# EAGLE schematic Mainboard v13 (EAGLE 9.4.2)

## Sheet 1 of 4
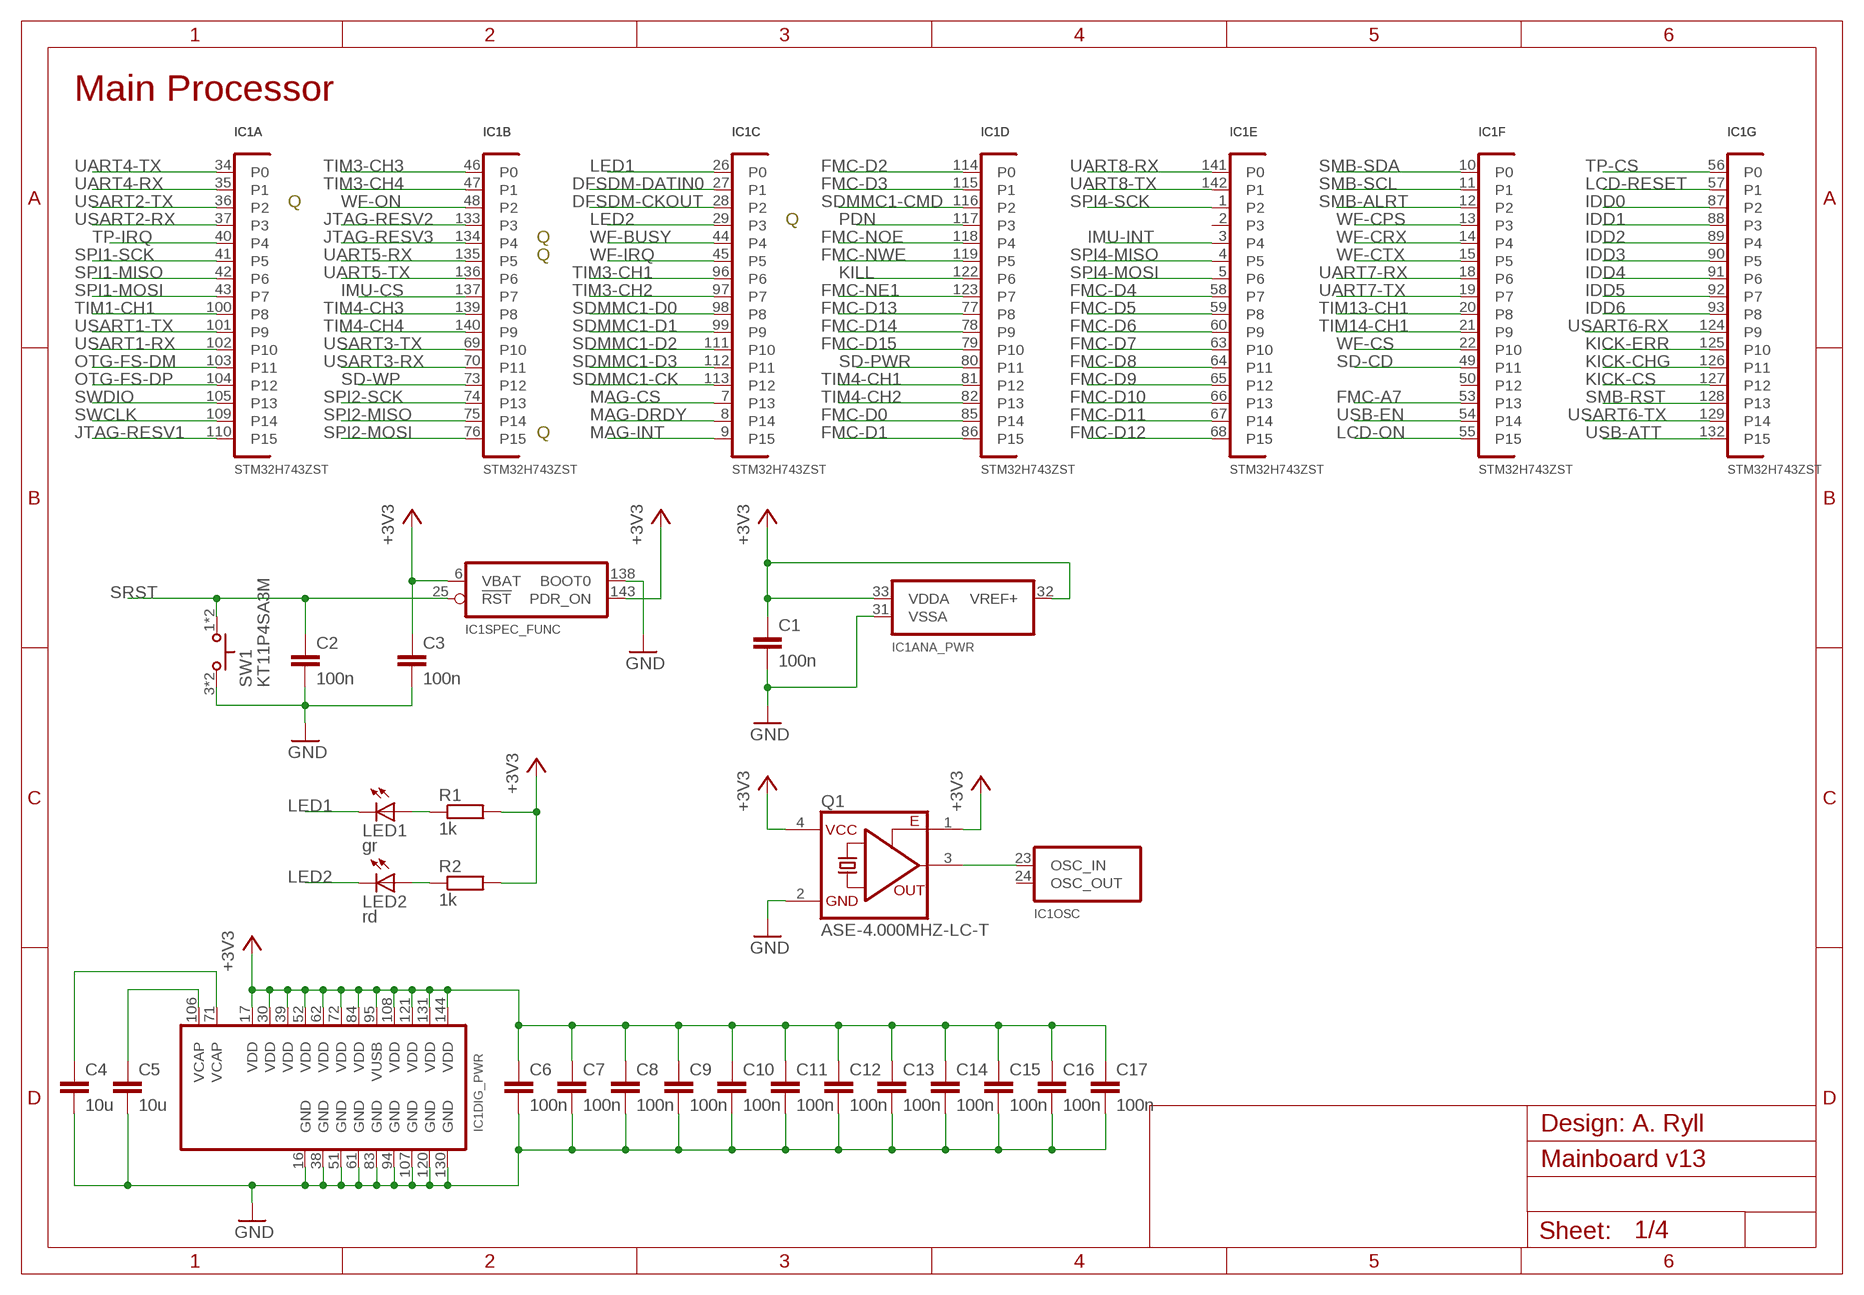
[diagram p0: schematic, sheet 1]

### Parts
C1  100n  C-EUC0603  [C0603]
C2  100n  C-EUC0603  [C0603]
C3  100n  C-EUC0603  [C0603]
C4  10u  C-EUC0603  [C0603]
C5  10u  C-EUC0603  [C0603]
C6  100n  C-EUC0603  [C0603]
C7  100n  C-EUC0603  [C0603]
C8  100n  C-EUC0603  [C0603]
C9  100n  C-EUC0603  [C0603]
C10  100n  C-EUC0603  [C0603]
C11  100n  C-EUC0603  [C0603]
C12  100n  C-EUC0603  [C0603]
C13  100n  C-EUC0603  [C0603]
C14  100n  C-EUC0603  [C0603]
C15  100n  C-EUC0603  [C0603]
C16  100n  C-EUC0603  [C0603]
C17  100n  C-EUC0603  [C0603]
IC1  STM32H743ZST  [LQFP144-ST]
LED1  gr  LEDCHIP-LED0603  [CHIP-LED0603]
LED2  rd  LEDCHIP-LED0603  [CHIP-LED0603]
Q1  ASE-4.000MHZ-LC-T  OSCIASE  [OSCI-ASE]
R1  1k  R-EU_R0603  [R0603]
R2  1k  R-EU_R0603  [R0603]
SW1  KT11P4SA3M  KT114  [BUTTON4]

### Nets
+3V3: C1.1 C3.1 C6.1 C7.1 C8.1 C9.1 C10.1 C11.1 C12.1 C13.1 C14.1 C15.1 C16.1 C17.1 IC1.6(SPEC_FUNC:VBAT) IC1.17(DIG_PWR:VDD) IC1.30(DIG_PWR:VDD) IC1.32(ANA_PWR:VREF+) IC1.33(ANA_PWR:VDDA) IC1.39(DIG_PWR:VDD) IC1.52(DIG_PWR:VDD) IC1.62(DIG_PWR:VDD) IC1.72(DIG_PWR:VDD) IC1.84(DIG_PWR:VDD) IC1.95(DIG_PWR:VUSB) IC1.108(DIG_PWR:VDD) IC1.121(DIG_PWR:VDD) IC1.131(DIG_PWR:VDD) IC1.143(SPEC_FUNC:PDR_ON) IC1.144(DIG_PWR:VDD) Q1.1(OE) Q1.4(VCC) R1.2 R2.2 ; also sheet 2,4
DFSDM-CKOUT: IC1.28(C:P2) ; also sheet 2
DFSDM-DATIN0: IC1.27(C:P1) ; also sheet 2
FMC-A7: IC1.53(F:P13) ; also sheet 2
FMC-D0: IC1.85(D:P14) ; also sheet 2
FMC-D1: IC1.86(D:P15) ; also sheet 2
FMC-D2: IC1.114(D:P0) ; also sheet 2
FMC-D3: IC1.115(D:P1) ; also sheet 2
FMC-D4: IC1.58(E:P7) ; also sheet 2
FMC-D5: IC1.59(E:P8) ; also sheet 2
FMC-D6: IC1.60(E:P9) ; also sheet 2
FMC-D7: IC1.63(E:P10) ; also sheet 2
FMC-D8: IC1.64(E:P11) ; also sheet 2
FMC-D9: IC1.65(E:P12) ; also sheet 2
FMC-D10: IC1.66(E:P13) ; also sheet 2
FMC-D11: IC1.67(E:P14) ; also sheet 2
FMC-D12: IC1.68(E:P15) ; also sheet 2
FMC-D13: IC1.77(D:P8) ; also sheet 2
FMC-D14: IC1.78(D:P9) ; also sheet 2
FMC-D15: IC1.79(D:P10) ; also sheet 2
FMC-NE1: IC1.123(D:P7) ; also sheet 2
FMC-NOE: IC1.118(D:P4) ; also sheet 2
FMC-NWE: IC1.119(D:P5) ; also sheet 2
GND: C1.2 C2.2 C3.2 C4.2 C5.2 C6.2 C7.2 C8.2 C9.2 C10.2 C11.2 C12.2 C13.2 C14.2 C15.2 C16.2 C17.2 IC1.16(DIG_PWR:GND) IC1.31(ANA_PWR:VSSA) IC1.38(DIG_PWR:GND) IC1.51(DIG_PWR:GND) IC1.61(DIG_PWR:GND) IC1.83(DIG_PWR:GND) IC1.94(DIG_PWR:GND) IC1.107(DIG_PWR:GND) IC1.120(DIG_PWR:GND) IC1.130(DIG_PWR:GND) IC1.138(SPEC_FUNC:BOOT0) Q1.2(GND) SW1.3 SW1.4 ; also sheet 2,3,4
IDD0: IC1.87(G:P2) ; also sheet 4
IDD1: IC1.88(G:P3) ; also sheet 4
IDD2: IC1.89(G:P4) ; also sheet 4
IDD3: IC1.90(G:P5) ; also sheet 4
IDD4: IC1.91(G:P6) ; also sheet 4
IDD5: IC1.92(G:P7) ; also sheet 4
IDD6: IC1.93(G:P8) ; also sheet 4
IMU-CS: IC1.137(B:P7) ; also sheet 2
IMU-INT: IC1.3(E:P4) ; also sheet 2
JTAG-RESV1: IC1.110(A:P15)
JTAG-RESV2: IC1.133(B:P3)
JTAG-RESV3: IC1.134(B:P4)
KICK-CHG: IC1.126(G:P11) ; also sheet 4
KICK-CS: IC1.127(G:P12) ; also sheet 4
KICK-ERR: IC1.125(G:P10) ; also sheet 4
KILL: IC1.122(D:P6) ; also sheet 4
LCD-ON: IC1.55(F:P15) ; also sheet 2
LCD-RESET: IC1.57(G:P1) ; also sheet 2
LED1: IC1.26(C:P0) LED1.C
LED2: IC1.29(C:P3) LED2.C
MAG-CS: IC1.7(C:P13) ; also sheet 2
MAG-DRDY: IC1.8(C:P14) ; also sheet 2
MAG-INT: IC1.9(C:P15) ; also sheet 2
N$9: LED1.A R1.1
N$10: LED2.A R2.1
N$124: IC1.23(OSC:OSC_IN) Q1.3(FO)
N$125: C5.1 IC1.106(DIG_PWR:VCAP)
N$126: C4.1 IC1.71(DIG_PWR:VCAP)
OTG-FS-DM: IC1.103(A:P11) ; also sheet 2
OTG-FS-DP: IC1.104(A:P12) ; also sheet 2
PDN: IC1.117(D:P3) ; also sheet 4
SD-CD: IC1.49(F:P11) ; also sheet 2
SD-PWR: IC1.80(D:P11) ; also sheet 2
SD-WP: IC1.73(B:P12) ; also sheet 2
SDMMC1-CK: IC1.113(C:P12) ; also sheet 2
SDMMC1-CMD: IC1.116(D:P2) ; also sheet 2
SDMMC1-D0: IC1.98(C:P8) ; also sheet 2
SDMMC1-D1: IC1.99(C:P9) ; also sheet 2
SDMMC1-D2: IC1.111(C:P10) ; also sheet 2
SDMMC1-D3: IC1.112(C:P11) ; also sheet 2
SMB-ALRT: IC1.12(F:P2) ; also sheet 4
SMB-RST: IC1.128(G:P13) ; also sheet 4
SMB-SCL: IC1.11(F:P1) ; also sheet 4
SMB-SDA: IC1.10(F:P0) ; also sheet 4
SPI1-MISO: IC1.42(A:P6) ; also sheet 3
SPI1-MOSI: IC1.43(A:P7) ; also sheet 3
SPI1-SCK: IC1.41(A:P5) ; also sheet 3
SPI2-MISO: IC1.75(B:P14) ; also sheet 4
SPI2-MOSI: IC1.76(B:P15) ; also sheet 4
SPI2-SCK: IC1.74(B:P13) ; also sheet 4
SPI4-MISO: IC1.4(E:P5) ; also sheet 2
SPI4-MOSI: IC1.5(E:P6) ; also sheet 2
SPI4-SCK: IC1.1(E:P2) ; also sheet 2
SRST: C2.1 IC1.25(SPEC_FUNC:!RST) SW1.1 SW1.2 ; also sheet 4
SWCLK: IC1.109(A:P14) ; also sheet 4
SWDIO: IC1.105(A:P13) ; also sheet 4
TIM1-CH1: IC1.100(A:P8) ; also sheet 4
TIM3-CH1: IC1.96(C:P6) ; also sheet 4
TIM3-CH2: IC1.97(C:P7) ; also sheet 4
TIM3-CH3: IC1.46(B:P0) ; also sheet 4
TIM3-CH4: IC1.47(B:P1) ; also sheet 4
TIM4-CH1: IC1.81(D:P12) ; also sheet 4
TIM4-CH2: IC1.82(D:P13) ; also sheet 4
TIM4-CH3: IC1.139(B:P8) ; also sheet 4
TIM4-CH4: IC1.140(B:P9) ; also sheet 4
TIM13-CH1: IC1.20(F:P8) ; also sheet 4
TIM14-CH1: IC1.21(F:P9) ; also sheet 4
TP-CS: IC1.56(G:P0) ; also sheet 2
TP-IRQ: IC1.40(A:P4) ; also sheet 2
UART4-RX: IC1.35(A:P1) ; also sheet 4
UART4-TX: IC1.34(A:P0) ; also sheet 4
UART5-RX: IC1.135(B:P5) ; also sheet 4
UART5-TX: IC1.136(B:P6) ; also sheet 4
UART7-RX: IC1.18(F:P6) ; also sheet 4
UART7-TX: IC1.19(F:P7) ; also sheet 4
UART8-RX: IC1.141(E:P0) ; also sheet 4
UART8-TX: IC1.142(E:P1) ; also sheet 4
USART1-RX: IC1.102(A:P10) ; also sheet 4
USART1-TX: IC1.101(A:P9) ; also sheet 4
USART2-RX: IC1.37(A:P3) ; also sheet 4
USART2-TX: IC1.36(A:P2) ; also sheet 4
USART3-RX: IC1.70(B:P11) ; also sheet 4
USART3-TX: IC1.69(B:P10) ; also sheet 4
USART6-RX: IC1.124(G:P9) ; also sheet 4
USART6-TX: IC1.129(G:P14) ; also sheet 4
USB-ATT: IC1.132(G:P15) ; also sheet 4
USB-EN: IC1.54(F:P14) ; also sheet 2
WF-BUSY: IC1.44(C:P4) ; also sheet 3
WF-CPS: IC1.13(F:P3) ; also sheet 3
WF-CRX: IC1.14(F:P4) ; also sheet 3
WF-CS: IC1.22(F:P10) ; also sheet 3
WF-CTX: IC1.15(F:P5) ; also sheet 3
WF-IRQ: IC1.45(C:P5) ; also sheet 3
WF-ON: IC1.48(B:P2) ; also sheet 3
Unconnected: IC1.2(E:P3) IC1.24(OSC:OSC_OUT) IC1.50(F:P12)

### Notes on the sheet
- Main Processor
- Q
- Q
- Q
- Q
- Q
- Design: A. Ryll

## Sheet 2 of 4
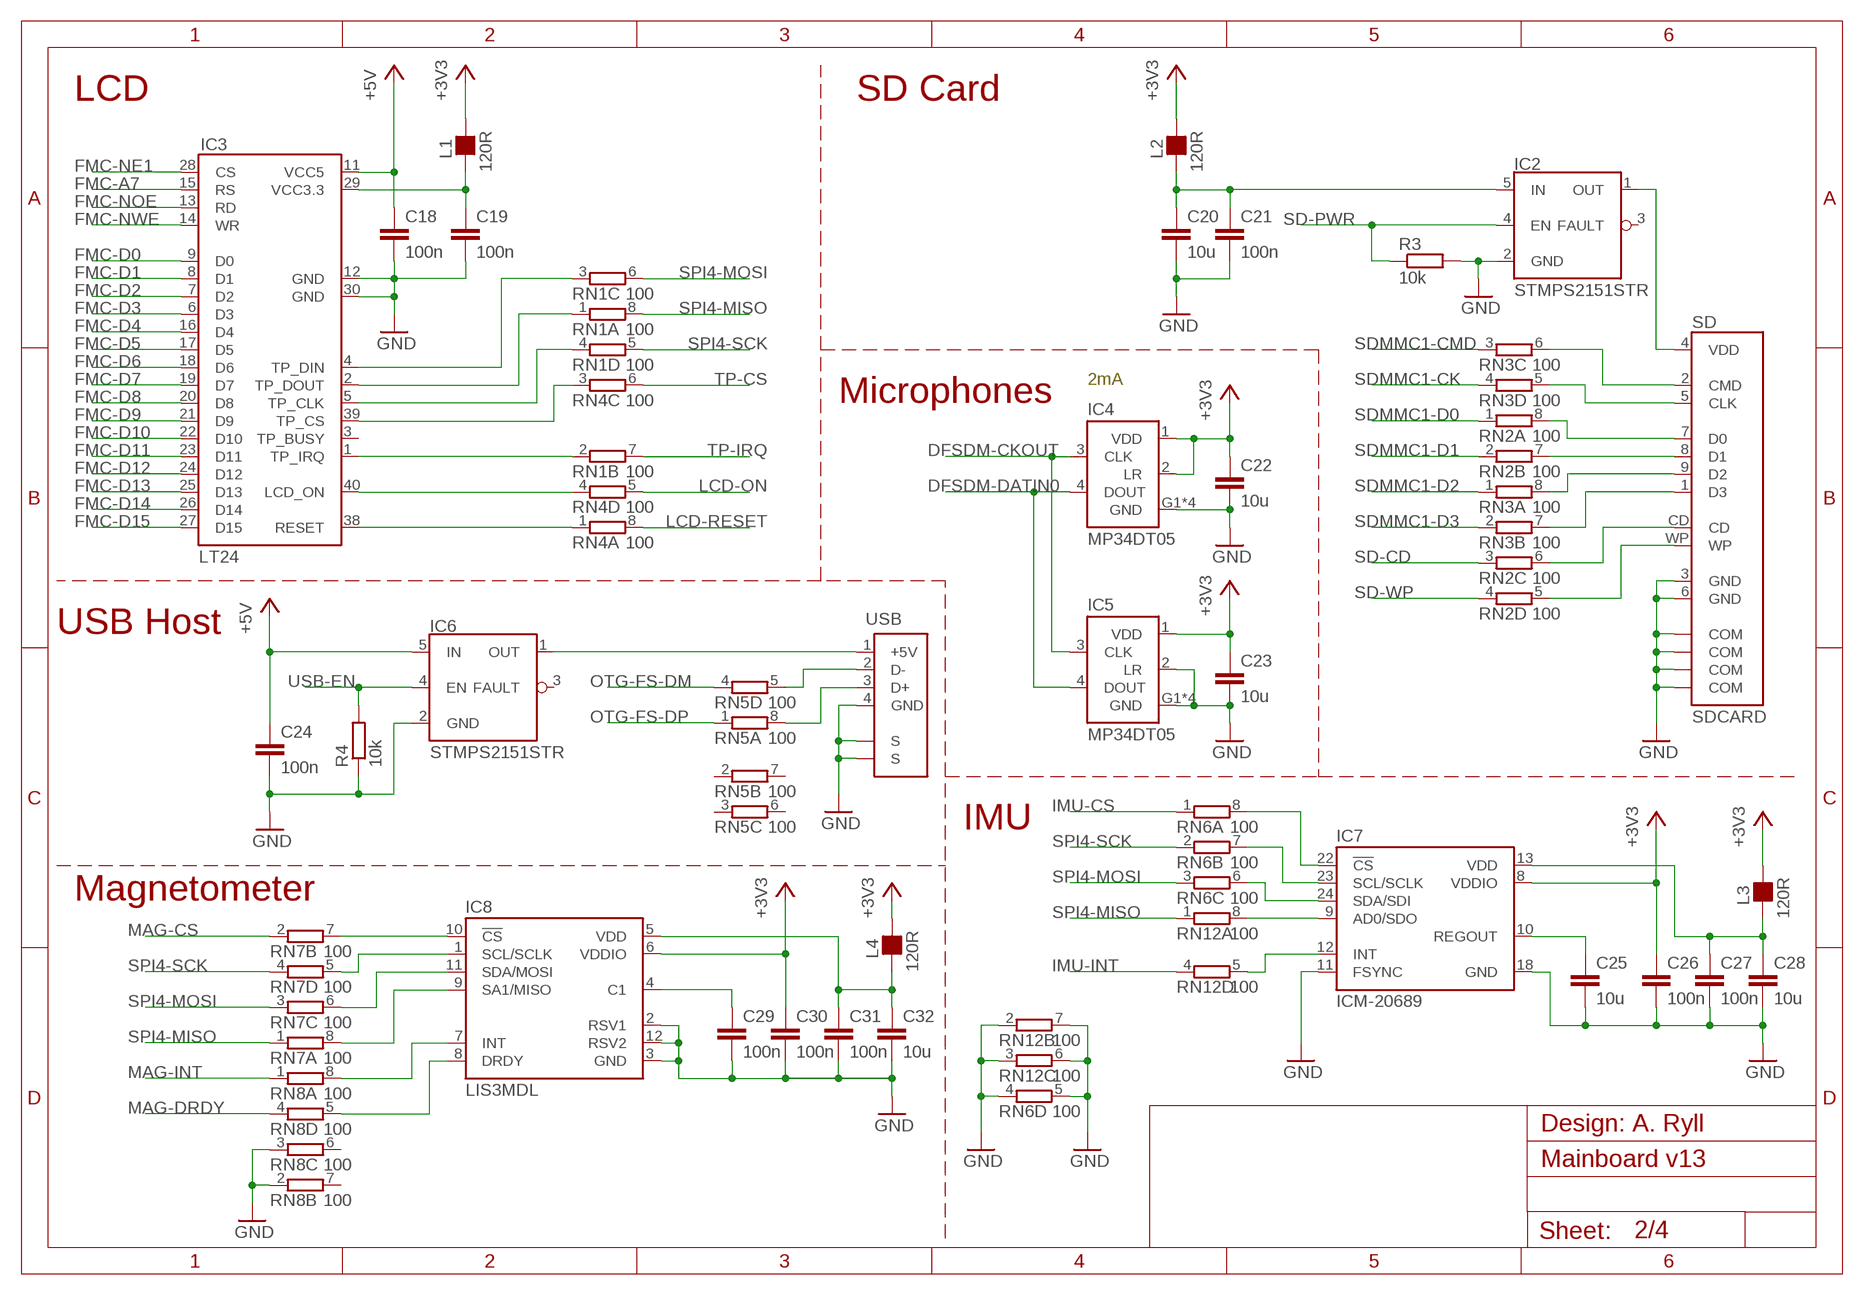
[diagram p1: schematic, sheet 2]

### Parts
C18  100n  C-EUC0603  [C0603]
C19  100n  C-EUC0603  [C0603]
C20  10u  C-EUC0603  [C0603]
C21  100n  C-EUC0603  [C0603]
C22  10u  C-EUC0603  [C0603]
C23  10u  C-EUC0603  [C0603]
C24  100n  C-EUC0603  [C0603]
C25  10u  C-EUC0603  [C0603]
C26  100n  C-EUC0603  [C0603]
C27  100n  C-EUC0603  [C0603]
C28  10u  C-EUC0603  [C0603]
C29  100n  C-EUC0603  [C0603]
C30  100n  C-EUC0603  [C0603]
C31  100n  C-EUC0603  [C0603]
C32  10u  C-EUC0603  [C0603]
IC2  STMPS2151STR  [SOT23-5]
IC3  LT24  [LT24]
IC4  MP34DT05  MP34DT04  [HCLGA4]
IC5  MP34DT05  MP34DT04  [HCLGA4]
IC6  STMPS2151STR  [SOT23-5]
IC7  ICM-20689  [QFN24-4X4-P]
IC8  LIS3MDL  [VFLGA-12]
L1  120R  FB_0603  [L0603]
L2  120R  FB_0603  [L0603]
L3  120R  FB_0603  [L0603]
L4  120R  FB_0603  [L0603]
R3  10k  R-EU_R0603  [R0603]
R4  10k  R-EU_R0603  [R0603]
RN1  100  4R-NEXB28V  [EXB28V]
RN2  100  4R-NEXB28V  [EXB28V]
RN3  100  4R-NEXB28V  [EXB28V]
RN4  100  4R-NEXB28V  [EXB28V]
RN5  100  4R-NEXB28V  [EXB28V]
RN6  100  4R-NEXB28V  [EXB28V]
RN7  100  4R-NEXB28V  [EXB28V]
RN8  100  4R-NEXB28V  [EXB28V]
RN12  100  4R-NEXB28V  [EXB28V]
SD  SDCARD  [SDCARD]
USB  USBATE  [USBA-TE]

### Nets
+3V3: C22.1 C23.1 C26.1 C30.1 IC4.1(VDD) IC4.2(LR) IC5.1(VDD) IC7.8(VDDIO) IC8.6(VDDIO) L1.2 L2.2 L3.2 L4.2 ; also sheet 1,4
+5V: C18.1 C24.1 IC3.11(VCC5) IC6.5(IN) ; also sheet 3,4
DFSDM-CKOUT: IC4.3(CLK) IC5.3(CLK) ; also sheet 1
DFSDM-DATIN0: IC4.4(DOUT) IC5.4(DOUT) ; also sheet 1
FMC-A7: IC3.15(RS) ; also sheet 1
FMC-D0: IC3.9(D0) ; also sheet 1
FMC-D1: IC3.8(D1) ; also sheet 1
FMC-D2: IC3.7(D2) ; also sheet 1
FMC-D3: IC3.6(D3) ; also sheet 1
FMC-D4: IC3.16(D4) ; also sheet 1
FMC-D5: IC3.17(D5) ; also sheet 1
FMC-D6: IC3.18(D6) ; also sheet 1
FMC-D7: IC3.19(D7) ; also sheet 1
FMC-D8: IC3.20(D8) ; also sheet 1
FMC-D9: IC3.21(D9) ; also sheet 1
FMC-D10: IC3.22(D10) ; also sheet 1
FMC-D11: IC3.23(D11) ; also sheet 1
FMC-D12: IC3.24(D12) ; also sheet 1
FMC-D13: IC3.25(D13) ; also sheet 1
FMC-D14: IC3.26(D14) ; also sheet 1
FMC-D15: IC3.27(D15) ; also sheet 1
FMC-NE1: IC3.28(CS) ; also sheet 1
FMC-NOE: IC3.13(RD) ; also sheet 1
FMC-NWE: IC3.14(WR) ; also sheet 1
GND: C18.2 C19.2 C20.2 C21.2 C22.2 C23.2 C24.2 C25.2 C26.2 C27.2 C28.2 C29.2 C30.2 C31.2 C32.2 IC2.2(GND) IC3.12(GND) IC3.30(GND) IC4.G1(GND) IC4.G2(GND) IC4.G3(GND) IC4.G4(GND) IC5.2(LR) IC5.G1(GND) IC5.G2(GND) IC5.G3(GND) IC5.G4(GND) IC6.2(GND) IC7.11(FSYNC) IC7.18(GND) IC8.2(RSV1) IC8.3(GND) IC8.12(RSV2) R3.2 R4.1 RN6.4 RN6.5 RN8.2 RN8.3 RN12.2 RN12.3 RN12.6 RN12.7 SD.3(GND) SD.6(GND) SD.COM1(COM) SD.COM2(COM) SD.COM3(COM) SD.COM4(COM) USB.4(GND) USB.MNT1(S) USB.MNT2(S) ; also sheet 1,3,4
IMU-CS: RN6.1 ; also sheet 1
IMU-INT: RN12.4 ; also sheet 1
LCD-ON: RN4.5 ; also sheet 1
LCD-RESET: RN4.8 ; also sheet 1
MAG-CS: RN7.2 ; also sheet 1
MAG-DRDY: RN8.4 ; also sheet 1
MAG-INT: RN8.1 ; also sheet 1
N$1: IC8.10(!CS) RN7.7
N$2: IC8.1(SCL/SCLK) RN7.5
N$3: IC8.11(SDA/MOSI) RN7.6
N$4: IC8.9(SA1/MISO) RN7.8
N$5: IC8.7(INT) RN8.8
N$6: IC8.8(DRDY) RN8.5
N$7: C29.1 IC8.4(C1)
N$8: C31.1 C32.1 IC8.5(VDD) L4.1
N$11: IC7.12(INT) RN12.5
N$127: C19.1 IC3.29(VCC3.3) L1.1
N$128: IC3.38(RESET) RN4.1
N$129: IC3.40(LCD_ON) RN4.4
N$130: IC3.1(TP_IRQ) RN1.2
N$131: IC3.39(TP_CS) RN4.3
N$132: IC3.5(TP_CLK) RN1.4
N$133: IC3.2(TP_DOUT) RN1.1
N$134: IC3.4(TP_DIN) RN1.3
N$135: RN2.7 SD.8(D1)
N$136: RN2.8 SD.7(D0)
N$137: RN3.5 SD.5(CLK)
N$138: RN3.6 SD.2(CMD)
N$139: RN3.8 SD.9(D2)
N$140: RN3.7 SD.1(D3)
N$141: RN2.6 SD.CD
N$142: RN2.5 SD.WP
N$143: C20.1 C21.1 IC2.5(IN) L2.1
N$145: IC6.1(OUT) USB.1(+5V)
N$146: RN5.5 USB.2(D-)
N$147: RN5.8 USB.3(D+)
N$148: IC7.9(AD0/SDO) RN12.8
N$149: C25.1 IC7.10(REGOUT)
N$150: C27.1 C28.1 IC7.13(VDD) L3.1
N$151: IC7.24(SDA/SDI) RN6.6
N$152: IC7.23(SCL/SCLK) RN6.7
N$153: IC7.22(!CS) RN6.8
OTG-FS-DM: RN5.4 ; also sheet 1
OTG-FS-DP: RN5.1 ; also sheet 1
SD-CD: RN2.3 ; also sheet 1
SD-PWR: IC2.4(EN) R3.1 ; also sheet 1
SD-WP: RN2.4 ; also sheet 1
SD_PWR: IC2.1(OUT) SD.4(VDD)
SDMMC1-CK: RN3.4 ; also sheet 1
SDMMC1-CMD: RN3.3 ; also sheet 1
SDMMC1-D0: RN2.1 ; also sheet 1
SDMMC1-D1: RN2.2 ; also sheet 1
SDMMC1-D2: RN3.1 ; also sheet 1
SDMMC1-D3: RN3.2 ; also sheet 1
SPI4-MISO: RN1.8 RN7.1 RN12.1 ; also sheet 1
SPI4-MOSI: RN1.6 RN6.3 RN7.3 ; also sheet 1
SPI4-SCK: RN1.5 RN6.2 RN7.4 ; also sheet 1
TP-CS: RN4.6 ; also sheet 1
TP-IRQ: RN1.7 ; also sheet 1
USB-EN: IC6.4(EN) R4.2 ; also sheet 1
Unconnected: IC2.3(FAULT) IC3.3(TP_BUSY) IC6.3(FAULT) RN4.2 RN4.7 RN5.2 RN5.3 RN5.6 RN5.7 RN8.6 RN8.7

### Notes on the sheet
- LCD | SD Card
- 2mA
- Microphones
- USB Host
- IMU
- Magnetometer
- Design: A. Ryll

## Sheet 3 of 4
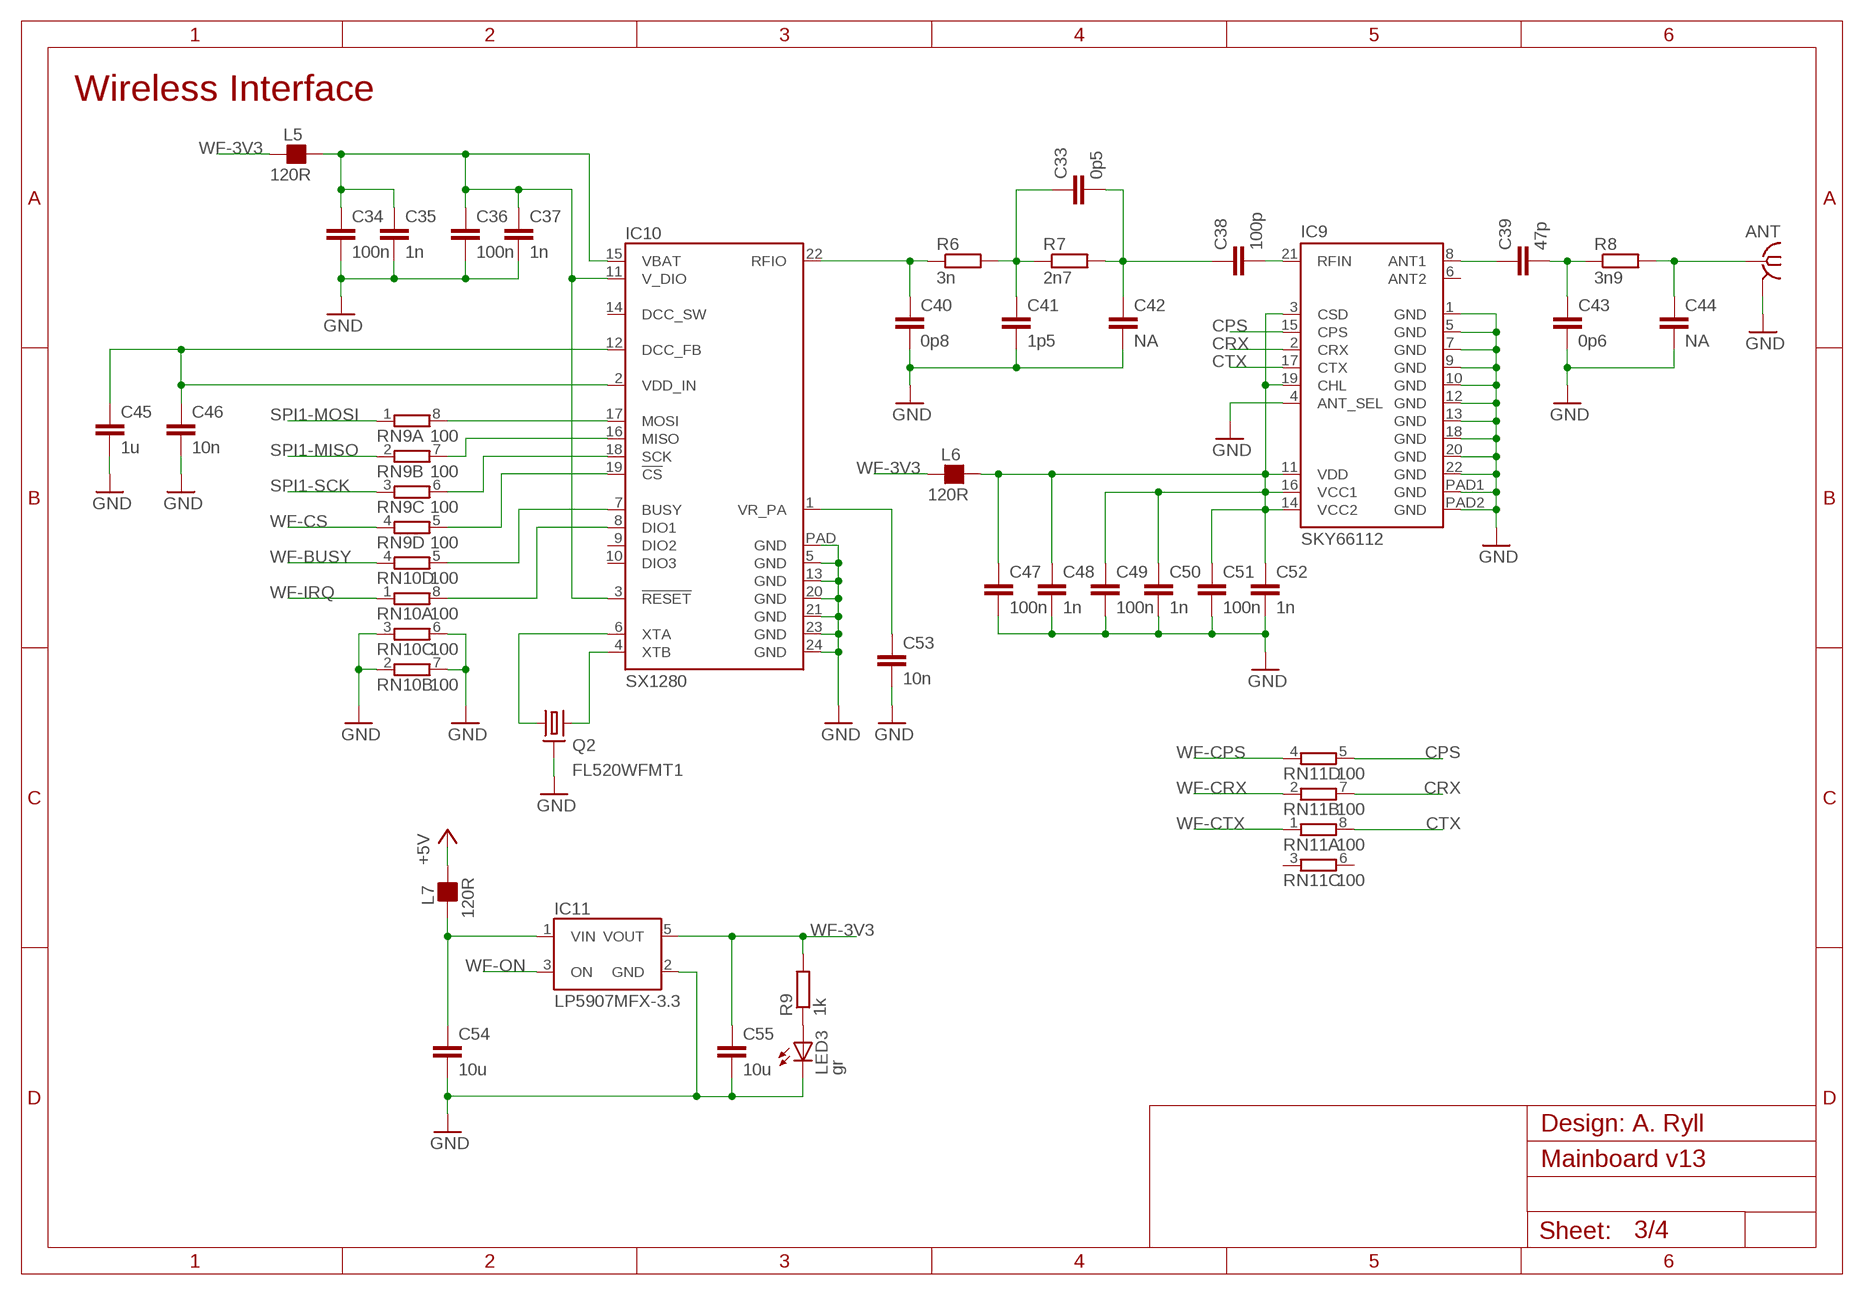
[diagram p2: schematic, sheet 3]

### Parts
ANT  ANT-SMARA  [ANT-SMA-RA]
C33  0p5  C-EUC0402  [C0402]
C34  100n  C-EUC0603  [C0603]
C35  1n  C-EUC0603  [C0603]
C36  100n  C-EUC0603  [C0603]
C37  1n  C-EUC0603  [C0603]
C38  100p  C-EUC0402  [C0402]
C39  47p  C-EUC0402  [C0402]
C40  0p8  C-EUC0402  [C0402]
C41  1p5  C-EUC0402  [C0402]
C42  NA  C-EUC0402  [C0402]
C43  0p6  C-EUC0402  [C0402]
C44  NA  C-EUC0402  [C0402]
C45  1u  C-EUC0603  [C0603]
C46  10n  C-EUC0603  [C0603]
C47  100n  C-EUC0603  [C0603]
C48  1n  C-EUC0603  [C0603]
C49  100n  C-EUC0603  [C0603]
C50  1n  C-EUC0603  [C0603]
C51  100n  C-EUC0603  [C0603]
C52  1n  C-EUC0603  [C0603]
C53  10n  C-EUC0603  [C0603]
C54  10u  C-EUC0603  [C0603]
C55  10u  C-EUC0603  [C0603]
IC9  SKY66112  [SMCM-22]
IC10  SX1280  [QFN24L]
IC11  LP5907MFX-3.3  LP2980  [SOT23-5L]
L5  120R  FB_0603  [L0603]
L6  120R  FB_0603  [L0603]
L7  120R  FB_0603  [L0603]
LED3  gr  LEDCHIP-LED0603  [CHIP-LED0603]
Q2  FL520WFMT1  CRYSTAL47M  [CRYSTAL-7M]
R6  3n  R-EU_R0402  [R0402]
R7  2n7  R-EU_R0402  [R0402]
R8  3n9  R-EU_R0402  [R0402]
R9  1k  R-EU_R0603  [R0603]
RN9  100  4R-NEXB28V  [EXB28V]
RN10  100  4R-NEXB28V  [EXB28V]
RN11  100  4R-NEXB28V  [EXB28V]

### Nets
+5V: L7.2 ; also sheet 2,4
CPS: IC9.15(CPS) RN11.5
CRX: IC9.2(CRX) RN11.7
CTX: IC9.17(CTX) RN11.8
GND: ANT.GND1(GND) ANT.GND2(GND) ANT.GND3(GND) ANT.GND4(GND) C34.2 C35.2 C36.2 C37.2 C40.2 C41.2 C42.2 C43.2 C44.2 C45.2 C46.2 C47.2 C48.2 C49.2 C50.2 C51.2 C52.2 C53.2 C54.2 C55.2 IC9.1(GND) IC9.4(ANT_SEL) IC9.5(GND) IC9.7(GND) IC9.9(GND) IC9.10(GND) IC9.12(GND) IC9.13(GND) IC9.18(GND) IC9.20(GND) IC9.22(GND) IC9.PAD1(GND) IC9.PAD2(GND) IC10.5(GND) IC10.13(GND) IC10.20(GND) IC10.21(GND) IC10.23(GND) IC10.24(GND) IC10.PAD(GND) IC11.2(GND) LED3.C Q2.2(GND1) Q2.4(GND1) RN10.2 RN10.3 RN10.6 RN10.7 ; also sheet 1,2,4
N$156: LED3.A R9.1
N$157: C54.1 IC11.1(VIN) L7.1
N$159: IC10.17(MOSI) RN9.8
N$160: IC10.16(MISO) RN9.7
N$161: IC10.18(SCK) RN9.6
N$162: IC10.19(!CS) RN9.5
N$163: IC10.7(BUSY) RN10.5
N$164: IC10.8(DIO1) RN10.8
N$165: IC10.4(XTB) Q2.3
N$166: IC10.6(XTA) Q2.1
N$167: C45.1 C46.1 IC10.2(VDD_IN) IC10.12(DCC_FB)
N$168: C53.1 IC10.1(VR_PA)
N$169: C38.2 IC9.21(RFIN)
N$170 [50Ohm]: C33.1 C41.1 R6.2 R7.1
N$171 [50Ohm]: C33.2 C38.1 C42.1 R7.2
N$172: C40.1 IC10.22(RFIO) R6.1
N$174: C39.1 IC9.8(ANT1)
N$175 [50Ohm]: C39.2 C43.1 R8.1
N$176 [50Ohm]: ANT.C C44.1 R8.2
SPI1-MISO: RN9.2 ; also sheet 1
SPI1-MOSI: RN9.1 ; also sheet 1
SPI1-SCK: RN9.3 ; also sheet 1
WF-3V3: C55.1 IC11.5(VOUT) L5.1 L6.1 R9.2
WF-BUSY: RN10.4 ; also sheet 1
WF-CPS: RN11.4 ; also sheet 1
WF-CRX: RN11.2 ; also sheet 1
WF-CS: RN9.4 ; also sheet 1
WF-CTX: RN11.1 ; also sheet 1
WF-IRQ: RN10.1 ; also sheet 1
WF-ON: IC11.3(ON) ; also sheet 1
WF_3V3FEM: C47.1 C48.1 C49.1 C50.1 C51.1 C52.1 IC9.3(CSD) IC9.11(VDD) IC9.14(VCC2) IC9.16(VCC1) IC9.19(CHL) L6.2
WF_3V3SX: C34.1 C35.1 C36.1 C37.1 IC10.3(!RESET) IC10.11(V_DIO) IC10.15(VBAT) L5.2
Unconnected: IC9.6(ANT2) IC10.9(DIO2) IC10.10(DIO3) IC10.14(DCC_SW) RN11.3 RN11.6

### Notes on the sheet
- Wireless Interface
- Design: A. Ryll

## Sheet 4 of 4
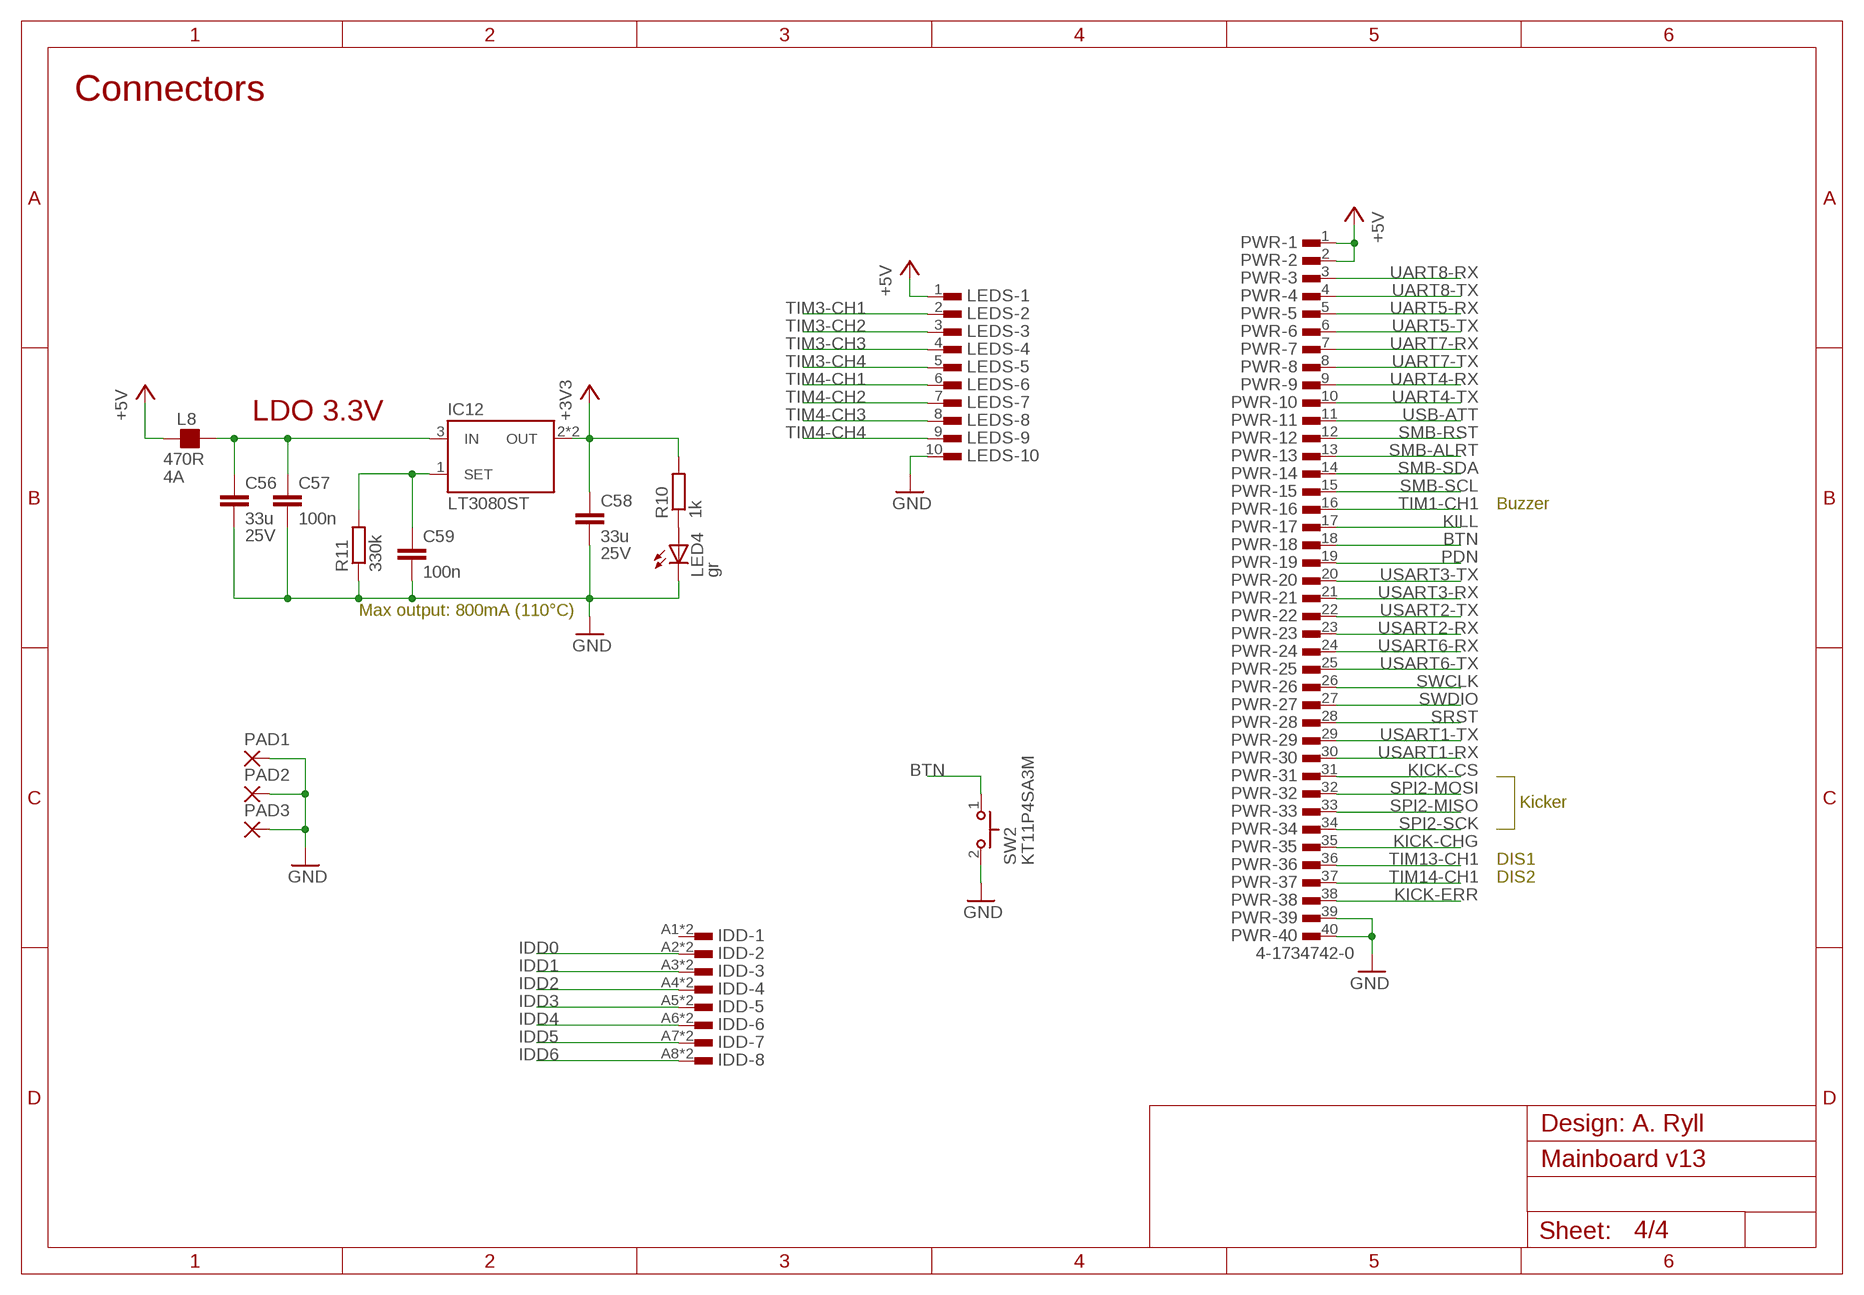
[diagram p3: schematic, sheet 4]

### Parts
C56  33u  C-EUC1206  [C1206]
C57  100n  C-EUC0603  [C0603]
C58  33u  C-EUC1206  [C1206]
C59  100n  C-EUC0603  [C0603]
IC12  LT3080ST  [SOT223]
IDD  TE-FPC-1MM-8V  [TE-1734248-8]
L8  470R  FB_1206  [L1206]
LED4  gr  LEDCHIP-LED0603  [CHIP-LED0603]
LEDS  TE-FPC-1MM-10H  [TE-1-84952-0]
PAD1  WIREPAD5,4/3,0  [5,4/3,0]
PAD2  WIREPAD5,4/3,0  [5,4/3,0]
PAD3  WIREPAD5,4/3,0  [5,4/3,0]
PWR  4-1734742-0  TE-FPC-0.5MM-40H  [TE-4-1734592-0]
R10  1k  R-EU_R0603  [R0603]
R11  330k  R-EU_R0603  [R0603]
SW2  KT11P4SA3M  KT11  [KT11]

### Nets
+3V3: C58.1 IC12.2(OUT) IC12.4(OUT) R10.2 ; also sheet 1,2
+5V: L8.1 LEDS.1 PWR.1 PWR.2 ; also sheet 2,3
BTN: PWR.18 SW2.1
GND: C56.2 C57.2 C58.2 C59.2 LED4.C LEDS.10 PAD1.1(P) PAD1.2(P) PAD2.1(P) PAD2.2(P) PAD3.1(P) PAD3.2(P) PWR.39 PWR.40 R11.1 SW2.2 ; also sheet 1,2,3
IDD0: IDD.A2 IDD.B2 ; also sheet 1
IDD1: IDD.A3 IDD.B3 ; also sheet 1
IDD2: IDD.A4 IDD.B4 ; also sheet 1
IDD3: IDD.A5 IDD.B5 ; also sheet 1
IDD4: IDD.A6 IDD.B6 ; also sheet 1
IDD5: IDD.A7 IDD.B7 ; also sheet 1
IDD6: IDD.A8 IDD.B8 ; also sheet 1
KICK-CHG: PWR.35 ; also sheet 1
KICK-CS: PWR.31 ; also sheet 1
KICK-ERR: PWR.38 ; also sheet 1
KILL: PWR.17 ; also sheet 1
N$107: C59.1 IC12.1(SET) R11.2
N$108: LED4.A R10.1
N$111: C56.1 C57.1 IC12.3(IN) L8.2
PDN: PWR.19 ; also sheet 1
SMB-ALRT: PWR.13 ; also sheet 1
SMB-RST: PWR.12 ; also sheet 1
SMB-SCL: PWR.15 ; also sheet 1
SMB-SDA: PWR.14 ; also sheet 1
SPI2-MISO: PWR.33 ; also sheet 1
SPI2-MOSI: PWR.32 ; also sheet 1
SPI2-SCK: PWR.34 ; also sheet 1
SRST: PWR.28 ; also sheet 1
SWCLK: PWR.26 ; also sheet 1
SWDIO: PWR.27 ; also sheet 1
TIM1-CH1: PWR.16 ; also sheet 1
TIM3-CH1: LEDS.2 ; also sheet 1
TIM3-CH2: LEDS.3 ; also sheet 1
TIM3-CH3: LEDS.4 ; also sheet 1
TIM3-CH4: LEDS.5 ; also sheet 1
TIM4-CH1: LEDS.6 ; also sheet 1
TIM4-CH2: LEDS.7 ; also sheet 1
TIM4-CH3: LEDS.8 ; also sheet 1
TIM4-CH4: LEDS.9 ; also sheet 1
TIM13-CH1: PWR.36 ; also sheet 1
TIM14-CH1: PWR.37 ; also sheet 1
UART4-RX: PWR.9 ; also sheet 1
UART4-TX: PWR.10 ; also sheet 1
UART5-RX: PWR.5 ; also sheet 1
UART5-TX: PWR.6 ; also sheet 1
UART7-RX: PWR.7 ; also sheet 1
UART7-TX: PWR.8 ; also sheet 1
UART8-RX: PWR.3 ; also sheet 1
UART8-TX: PWR.4 ; also sheet 1
USART1-RX: PWR.30 ; also sheet 1
USART1-TX: PWR.29 ; also sheet 1
USART2-RX: PWR.23 ; also sheet 1
USART2-TX: PWR.22 ; also sheet 1
USART3-RX: PWR.21 ; also sheet 1
USART3-TX: PWR.20 ; also sheet 1
USART6-RX: PWR.24 ; also sheet 1
USART6-TX: PWR.25 ; also sheet 1
USB-ATT: PWR.11 ; also sheet 1
Unconnected: IDD.A1 IDD.B1

### Notes on the sheet
- Connectors
- LDO 3.3V
- Buzzer
- Max output: 800mA (110°C)
- Kicker
- DIS1
- DIS2
- Design: A. Ryll

## Library data of the parts
ANT = TIGERs:ANT-SMA
C1-C55 C57 C59 = rcl:C-EU: CAPACITOR, European symbol; SPICEPREFIX: C
C56 C58 = rcl:C-EU: CAPACITOR, European symbol; SPICEPREFIX: C; VOLTAGE: 25V
IC1 = TIGERs:STM32H743Z: STM32H743Z 400 MHz, 1MB RAM, 2MB Flash
IC2 IC6 = TIGERs:STMPS21
IC3 = TIGERs:LT24: Terasic LT24 Display Board Header: TSM-120-01-T-DV-P
IC4 IC5 = TIGERs:MP34DT04
IC7 = TIGERs:ICM-20689
IC8 = TIGERs:LIS3MDL
IC9 = TIGERs:SKY66112: SKY66112-11
IC10 = TIGERs:SX1280
IC11 = TIGERs:LP2980
IC12 = TIGERs:LT3080ST
IDD = TIGERs:TE-FPC-1MM-8: TE Connectivity 1.0 FPC, ZIF V/T, SMT, 10P Part Number: 1-1734248-0
L1-L7 = rc-master-smd:FB_: FERRITE BEAD
L8 = rc-master-smd:FB_: FERRITE BEAD; IMAX: 4A
LED1-LED4 = led:LED: LED OSRAM: - CHIPLED LG R971, LG N971, LY N971, LG Q971, LY Q971, LO R971, LY R971 LH N974, LH R974 LS Q976, LO Q976, LY Q976 LO Q996 - Hyper CHIPLED LW Q18S LB Q993, LB Q99A, LB R99A - SideLED LS A670, LO A670, LY A670, LG A670, LP A670 LB A673, LV A673, LT A673, LW A673 LH A674 LY A675 LS A676, LA A676, LO A676, LY A676, LW A676 LS A679, LY A679, LG A679 - Hyper Micro SIDELED® LS Y876, LA Y876, LO Y876, LY Y876 LT Y87S - SmartLED LW L88C, LW L88S LB L89C, LB L89S, LG L890 LS L89K, LO L89K, LY L89K LS L896, LA L896, LO L896, LY L896 - TOPLED LS T670, LO T670, LY T670, LG T670, LP T670 LSG T670, LSP T670, LSY T670, LOP T670, LYG T670 LG T671, LOG T671, LSG T671 LB T673, LV T673, LT T673, LW T673 LH T674 LS T676, LA T676, LO T676, LY T676, LB T676, LH T676, LSB T676, LW T676 LB T67C, LV T67C, LT T67C, LS T67K, LO T67K, LY T67K, LW E67C LS E67B, LA E67B, LO E67B, LY E67B, LB E67C, LV E67C, LT E67C LW T67C LS T679, LY T679, LG T679 LS T770, LO T770, LY T770, LG T770, LP T770 LB T773, LV T773, LT T773, LW T773 LH T774 LS E675, LA E675, LY E675, LS T675 LS T776, LA T776, LO T776, LY T776, LB T776 LHGB T686 LT T68C, LB T68C - Hyper Mini TOPLED® LB M676 - Mini TOPLED Santana® LG M470 LS M47K, LO M47K, LY M47K Source: http://www.osram.convergy.de LUXEON: - LUMILED® LXK2-PW12-R00, LXK2-PW12-S00, LXK2-PW14-U00, LXK2-PW14-V00 LXK2-PM12-R00, LXK2-PM12-S00, LXK2-PM14-U00 LXK2-PE12-Q00, LXK2-PE12-R00, LXK2-PE12-S00, LXK2-PE14-T00, LXK2-PE14-U00 LXK2-PB12-K00, LXK2-PB12-L00, LXK2-PB12-M00, LXK2-PB14-N00, LXK2-PB14-P00, LXK2-PB14-Q00 LXK2-PR12-L00, LXK2-PR12-M00, LXK2-PR14-Q00, LXK2-PR14-R00 LXK2-PD12-Q00, LXK2-PD12-R00, LXK2-PD12-S00 LXK2-PH12-R00, LXK2-PH12-S00 LXK2-PL12-P00, LXK2-PL12-Q00, LXK2-PL12-R00 Source: www.luxeon.com KINGBRIGHT: KA-3528ASYC Source: www.kingbright.com
LEDS = TIGERs:TE-FPC-1MM-10: TE Connectivity 1.0 FPC, ZIF V/T, SMT, 10P Part Number: 1-1734248-0
PAD1-PAD3 = TIGERs:WIREPAD: Wire PAD connect wire on PCB
PWR = TIGERs:TE-FPC-0.5MM-40: TE Connectivity 0.5 FPC, ZIF V/T, SMT, 30P Part Numbers: Vertical: 3-1734742-0 Horizontal: 3-1734592-0
Q1 = TIGERs:OSCI
Q2 = TIGERs:CRYSTAL4
R1-R4 R6-R11 = rcl:R-EU_: RESISTOR, European symbol; SPICEPREFIX: R
RN1-RN12 = resistor-dil:4R-N: Array Chip Resistor Source: RS Component / Phycomp; OC_FARNELL: unknown; OC_NEWARK: unknown
SD = TIGERs:SDCARD: TE Connectivity 2041021-3 SD Card Socket Farnell Order Number: 2112526
SW1 SW2 = TIGERs:KT11
USB = TIGERs:USBA: Multicomp connector Farnell: 2112370

## Net classes
1 50Ohm: width 0.643 mm, clearance 0.35 mm